# Altium schematic sheet Photodiode Receiver.SchDoc
size A; SheetNumber: 5; SheetTotal: 5
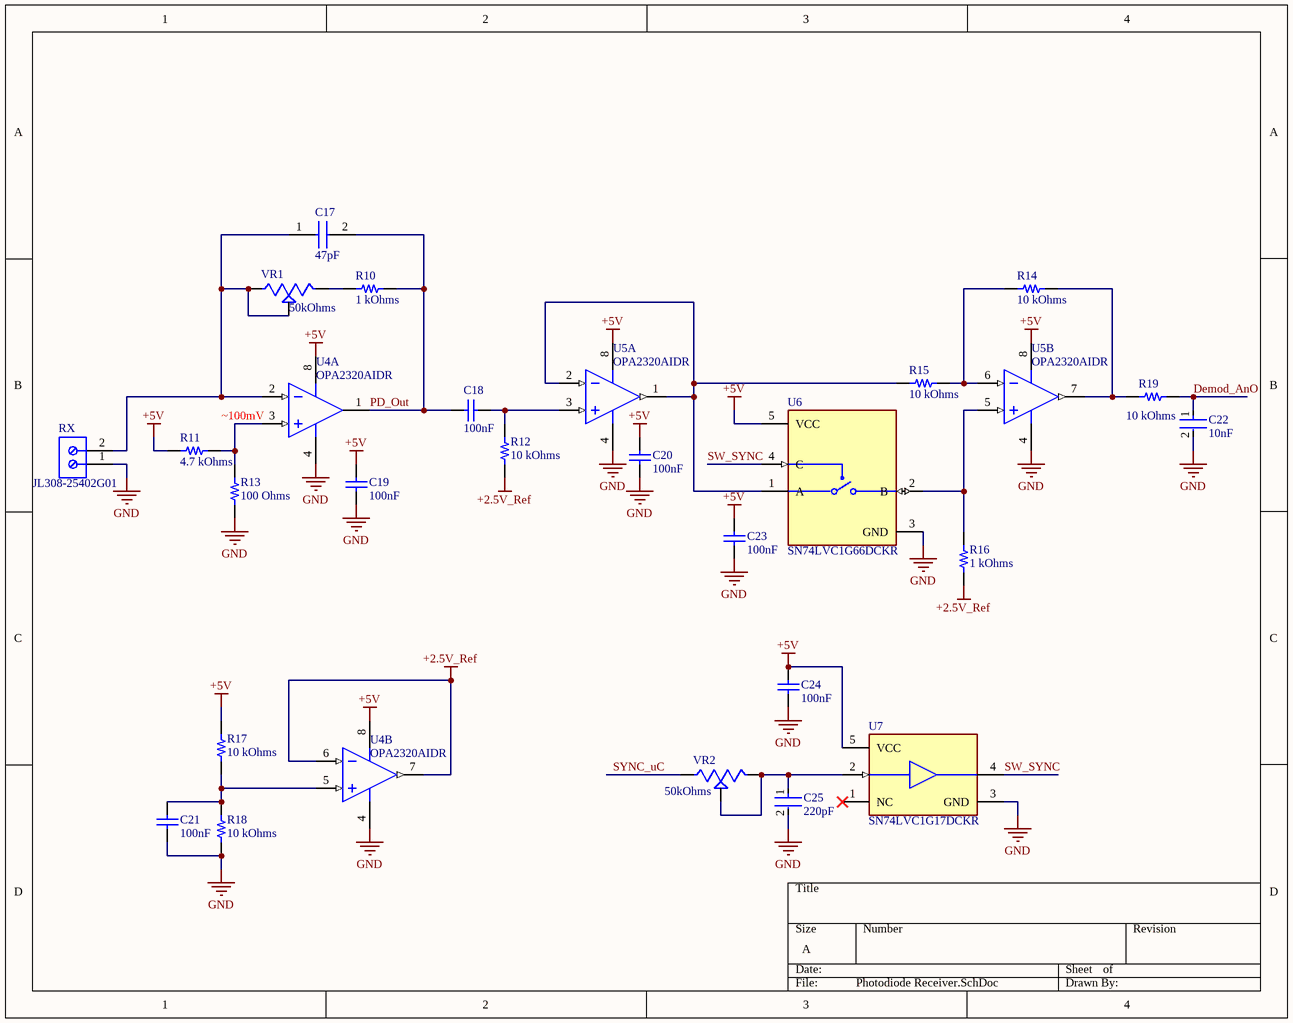
[diagram p0: Photodiode Receiver.SchDoc]

## Parts
C17  47pF  [CAPC1005X55N]
C18  100nF  [CAPC1050X55X23ML05T13]
C19  100nF  [CAPC1050X55X23ML05T13]
C20  100nF  [CAPC1050X55X23ML05T13]
C21  100nF  [CAPC1050X55X23ML05T13]
C22  10nF  [FP-CL165-IPC_C]
C23  100nF  [CAPC1050X55X23ML05T13]
C24  100nF  [CAPC1050X55X23ML05T13]
C25  220pF  [FP-CL10-IPC_A]
R10  1 kOhms  [RES 0402_1005]
R11  4.7 kOhms  [RES 0402_1005]
R12  10 kOhms  [RES 0402_1005]
R13  100 Ohms  [RES 0402_1005]
R14  10 kOhms  [RES 0402_1005]
R15  10 kOhms  [RES 0402_1005]
R16  1 kOhms  [RES 0402_1005]
R17  10 kOhms  [RES 0402_1005]
R18  10 kOhms  [RES 0402_1005]
R19  10 kOhms  [RES 0402_1005]
RX  JL308-25402G01  [691210910002]
U4  OPA2320AIDR  [D0008A_L]  (parts A,B of 2)
U5  OPA2320AIDR  [D0008A_L]  (parts A,B of 2)
U6  SN74LVC1G66DCKR  [FP-DCK0005A-MFG]
U7  SN74LVC1G17DCKR  [FP-DCK0005A-MFG]
VR1  50kOhms  [TRIM_3314J-1-503E]
VR2  50kOhms  [TRIM_3314J-1-503E]

## Nets
+2.5V_Ref: R12.1 R16.2 U4.6(IN_B-) U4.7(OUT_B)
+5V: C19.2 C20.2 C23.2 C24.2 R11.1 R17.2 U4.8(V+) U5.8(V+) U6.5(VCC) U7.5(VCC)
GND: C19.1 C20.1 C21.1 C22.2 C23.1 C24.1 C25.2 R13.1 R18.1 RX.1 U4.4(V-) U5.4(V-) U6.3(GND) U7.3(GND)
Demod_AnO: C22.1 R19.1
PD_Out: C17.2 C18.2 R10.1 U4.1(OUT_A)
SW_SYNC: U6.4(C) U7.4(Y)
SYNC_uC: VR2.3(CW)
NetC17_1: C17.1 RX.2 U4.2(IN_A-) VR1.2(WIPER) VR1.3(CW)
NetC18_1: C18.1 R12.2 U5.3(IN_A+)
NetC21_2: C21.2 R17.1 R18.2 U4.5(IN_B+)
NetC25_1: C25.1 U7.2(A) VR2.1(CCW) VR2.2(WIPER)
NetR10_2: R10.2 VR1.1(CCW)
NetR11_2: R11.2 R13.2 U4.3(IN_A+)
NetR14_1: R14.1 R19.2 U5.7(OUT_B)
NetR14_2: R14.2 R15.1 U5.6(IN_B-)
NetR15_2: R15.2 U5.1(OUT_A) U5.2(IN_A-) U6.1(A)
NetR16_1: R16.1 U5.5(IN_B+) U6.2(B)

Not connected (* = marked no-connect by the designer): U7 1(NC)*

## Notes on the sheet
- ~100mV

## Library data of the parts
C17 = 0402CG470J500NT: Capacitor 0402CG470J500NT; Manufacturer_Name: Guangdong Fenghua Advanced Tech; Datasheet Link: https://datasheet.lcsc.com/szlcsc/Guangdong-Fenghua-Advanced-Tech-0402CG470J500NT_C1567.pdf; Height: 0.55mm; Manufacturer_Part_Number: 0402CG470J500NT
C18-C21 C23 C24 = CMP-2000-05439-1: Chip Capacitor, 100 nF, +/- 10%, 16 V, -55 to 125 degC, 0402 (1005 Metric), RoHS, Tape and Reel; Manufacturer: Samsung Electro-Mechanics; Capacitance: 100000pF; Dielectric: X7R; Rated Voltage: 16V; Case Size/Dimension: 0402; Tolerance (%): ±10%; Manufacturer URL: http://www.samsungsem.com/global/index.jsp; Datasheet URL: https://datasheet.ciiva.com/29198/458718-da-01-en-vs-kondensator-0402-29198423.pdf; Datasheet Version: Nov-10
C22 = CMP-13271-000387-1: Cap Ceramic 10nF 50V X7R ±10% SMD 0402 +125°C Paper T/R; Depth: 0.5mm; Length: 1mm; Lead Free: Lead Free; Case Code (Metric): 1005; Width: 0.02inch; Min Operating Temperature: -55°C; Thickness: 0.022inch; Package Quantity: 1; Mount: Surface Mount; Height: 0.5mm; Voltage: 50V; Material: Ceramic; Tolerance: 10%; Case Code (Imperial): 0402; Radiation Hardening: No; Case/Package: 0402; Max Operating Temperature: 125°C; Voltage Rating (DC): 50V; Contact Plating: Tin; Packaging: Tape and Reel; Voltage Rating: 50V; Capacitance: 10nF; Dielectric: X7R
C25 = CMP-13271-000087-1: Cap Ceramic 220pF 50V X7R ±10% Pad SMD 0603 +125°C T/R; Voltage Rating: 50V; Case Code (Metric): 1608; Radiation Hardening: No; Dielectric: X7R; Mount: Surface Mount; Length: 1.6mm; Thickness: 0.035inch; Packaging: Tape and Reel; Height: 0.8mm; Depth: 0.8mm; Tolerance: 10%; Width: 0.031inch; Case Code (Imperial): 0603; Voltage: 50V; Material: Ceramic; Case/Package: 0603; Capacitance: 220pF; Max Operating Temperature: 125°C; Min Operating Temperature: -55°C; Contact Plating: Tin
R10 R16 = CPF0402B1K0E: RES SMD 1K OHM 0.1% 1/16W 0402; Manufacturer: TE Connectivity Passive Product; Power (Watts): 0.063W, 1/16W; Temperature Coefficient: ±25ppm/°C; Part Number: CPF0402B1K0E; Value: 1 kOhms; ComponentLink1Description: Datasheet; ComponentLink1URL: https://www.te.com/commerce/DocumentDelivery/DDEController?Action=srchrtrv&DocNm=1773200&DocType=DS&DocLang=English; ComponentLink2Description: DigiKey Link; ComponentLink2URL: https://www.digikey.com/en/products/detail/te-connectivity-passive-product/CPF0402B1K0E/4966468; Composition: Thin Film; Device Package: 0402 (1005 Metric); Height - Seated (Max): 0.014" (0.35mm); LastUpdated: 2/9/2024 8:30:24 PM; Lifecycle Status: Active; Minimum Order: 1; Number of Terminations: 2; Operating Temperature: -55°C ~ 155°C; Package / Case: 0402 (1005 Metric); Packaging: TapeAndReel; PartId: 2470; Part Status: Active; Price: 0.10; Resistance: 1 kOhms; Series: CPF, Neohm; Size / Dimension: 0.039" L x 0.020" W (1.00mm x 0.50mm); Supplier 1: DigiKey; Supplier Part Number 1: A119928CT-ND; Supplier Device Package: 0402; Tolerance: ±0.1%
R11 = RR0510P-472-D: RES SMD 4.7K OHM 0.5% 1/16W 0402; Manufacturer: Susumu; Power (Watts): 0.063W, 1/16W; Temperature Coefficient: ±25ppm/°C; Part Number: RR0510P-472-D; Value: 4.7 kOhms; ComponentLink1Description: Datasheet; ComponentLink1URL: http://www.susumu.co.jp/common/pdf/n_catalog_partition05_en.pdf; ComponentLink2Description: DigiKey Link; ComponentLink2URL: https://www.digikey.com/en/products/detail/susumu/RR0510P-472-D/432413; Composition: Thin Film; Device Package: 0402 (1005 Metric); Height - Seated (Max): 0.016" (0.40mm); LastUpdated: 2/9/2024 8:30:21 PM; Lifecycle Status: Active; Minimum Order: 1; Number of Terminations: 2; Operating Temperature: -55°C ~ 125°C; Package / Case: 0402 (1005 Metric); Packaging: TapeAndReel; PartId: 3209; Part Status: Active; Price: 0.01; Resistance: 4.7 kOhms; Series: RR; Size / Dimension: 0.039" L x 0.020" W (1.00mm x 0.50mm); Supplier 1: DigiKey; Supplier Part Number 1: RR05P4.7KDCT-ND; Tolerance: ±0.5%
R12 R14 R15 R17-R19 = CRCW040210K0FKEE: RES SMD 10K OHM 1% 1/16W 0402; Manufacturer: Vishay Dale; Power (Watts): 0.063W, 1/16W; Temperature Coefficient: ±100ppm/°C; Part Number: CRCW040210K0FKEE; Value: 10 kOhms; ComponentLink1Description: Datasheet; ComponentLink1URL: http://www.vishay.com/docs/20035/dcrcwe3.pdf; ComponentLink2Description: DigiKey Link; ComponentLink2URL: https://www.digikey.com/en/products/detail/vishay-dale/CRCW040210K0FKEE/5069897; Composition: Thick Film; Device Package: 0402 (1005 Metric); Features: Automotive AEC-Q200; Height - Seated (Max): 0.016" (0.40mm); LastUpdated: 2/9/2024 8:30:20 PM; Lifecycle Status: Active; Minimum Order: 1; Number of Terminations: 2; Operating Temperature: -55°C ~ 155°C; Package / Case: 0402 (1005 Metric); Packaging: CutTape; PartId: 3471; Part Status: Active; Price: 0.01; Ratings: AEC-Q200; Resistance: 10 kOhms; Series: CRCW; Size / Dimension: 0.039" L x 0.020" W (1.00mm x 0.50mm); Supplier 1: DigiKey; Supplier Part Number 1: 541-2954-1-ND; Supplier Device Package: 0402; Tolerance: ±1%
R13 = RR0510P-101-D: RES SMD 100 OHM 0.5% 1/16W 0402; Manufacturer: Susumu; Power (Watts): 0.063W, 1/16W; Temperature Coefficient: ±25ppm/°C; Part Number: RR0510P-101-D; Value: 100 Ohms; ComponentLink1Description: Datasheet; ComponentLink1URL: http://www.susumu.co.jp/common/pdf/n_catalog_partition05_en.pdf; ComponentLink2Description: DigiKey Link; ComponentLink2URL: https://www.digikey.com/en/products/detail/susumu/RR0510P-101-D/432375; Composition: Thin Film; Device Package: 0402 (1005 Metric); Height - Seated (Max): 0.016" (0.40mm); LastUpdated: 2/9/2024 8:30:21 PM; Lifecycle Status: Active; Minimum Order: 1; Number of Terminations: 2; Operating Temperature: -55°C ~ 125°C; Package / Case: 0402 (1005 Metric); Packaging: TapeAndReel; PartId: 3205; Part Status: Active; Price: 0.01; Resistance: 100 Ohms; Series: RR; Size / Dimension: 0.039" L x 0.020" W (1.00mm x 0.50mm); Supplier 1: DigiKey; Supplier Part Number 1: RR05P100DCT-ND; Tolerance: ±0.5%
RX = CMP-1502-02456-2: Use comment for part number; NexarPartId: 105950649; Current Rating: 6A; Voltage Rating: 150V; Number of Contacts: 2; Number of Rows: 1; Contact Material: Tin; Height: 8.7mm; Max Operating Temperature: 105°C; Min Operating Temperature: -40°C
U4 U5 = CMP-0272-00771-3: Precision, 20 MHz, 0.9 pA Ib, RRIO, CMOS Operational Amplifier, 1.8 to 5.5 V, -40 to 125 degC, 8-pin SOIC (D8), Green (RoHS & no Sb/Br); Manufacturer: Texas Instruments; IIB(Max)(pA): 400; Iq per channel(Max)(mA): 1.6; Number of Channels: 2; Total Supply Voltage(Min)(+5V is 5, +/-5V is 10): 1.8; CMRR(Min)(dB): 100; Slew Rate(Typ)(V/us): 10; Vio (25C)(Max)(mV): 0.15; Total Supply Voltage(Max)(+5V is 5, +/-5V is 10): 5.5; Vn at 1kHz(Typ)(nV/rtHz): 8.5; Sub Family: High Output Current Amplifier (>=50mA), Low Input Bias Current Amp (<=10pA), Low Noise Amp (<=10nV/rtHz), Low Offset Voltage Amplifier (<=500uV), Low Supply Voltage Amplifier (<=2.7V), Precision Amplifier; Offset Drift(Typ)(uV/C): 1.5; Code_JEDEC: MS-012; Eco-Plan: Green (RoHS & no Sb/Br); ComponentLink3URL: http://www.ti.com/litv/pdf/msoi002j; PackageVersion: 4040047-3/M, 06/2011; ComponentLink2URL: http://www.ti.com/general/docs/lit/getliterature.tsp?genericPartNumber=OPA2320&fileType=pdf; DatasheetVersion: SBOS513D; ComponentLink3Description: Package Specification; Mounting Technology: Surface Mount; PackageReference: D0008A; PackageDescription: 8-Pin Plastic Small Outline, Body 4.9 x 3.9 mm, Pitch 1.27 mm; PartNumber: OPA2320AIDR; ComponentLink1Description: Manufacturer URL; ComponentLink1URL: http://www.ti.com/; ComponentLink2Description: Datasheet
U6 = CMP-0859-00385-4: IC SWITCH 1X1 SC70-5; Manufacturer: Texas Instruments; Throw Configuration: SPST-NO; Nominal Supply Current: 1uA; Max Supply Voltage: 5.5V; Standoff Height: 0mm; -3Db Bandwith: 300MHz; On State Resistance: 5.5Ω; Mux Demux Ratio: 1:1; Max Junction Temp: +150°C; Min Supply Voltage: 1.65V; Number Of Circuits: 1; Octopart: https://octopart.com/sn74lvc1g66dckr-texas+instruments-472215; Temperature Range Low: -40°C; Mouser Description: Analogue Switch, Single Channel, SPST, 1, 10 ohm, 1.65V to 5.5V, SC-70, 5; Height: 1.1mm; ComponentLink2Description: Datasheet; RoHS: TRUE; Package: DCK0005A; Manufacturer Part Number: SN74LVC1G66DCKR; Digikey Description: IC SWITCH 1X1 SC70-5; Temperature: -40°C to +85°C; Temperature Range High: +85°C; ComponentLink2URL: http://www.ti.com/lit/ds/symlink/sn74lvc1g66.pdf; Lead Free: Yes; Device Class L3: Analog Switches; Device Class L2: Interface ICs; Ambient Temperature Range High: +85°C; Ambient Temperature Range Low: -40°C; Category: IC; Automotive: No; Device Class L1: Integrated Circuits (ICs)
U7 = CMP-0859-00388-5: IC BUF NON-INVERT 5.5V SC70-5; Number of Elements: 1; Polarity: Non-Inverting; Low Level Output Current: 32mA; Propagation Delay: 11ns; Logic Function: Schmitt Trigger; Min Supply Voltage: 1.65V; Quiescent Current: 1.5uA; High Level Output Current: -32mA; Packaging: Tape and Reel; Number of Gates: 1; Number of Output Lines: 1; Package Quantity: 1; Radiation Hardening: No; Max Supply Voltage: 5.5V; Contact Plating: Gold; Number of Outputs: 1; Number of Channels: 1; Termination: SMD/SMT; REACH SVHC: No SVHC; Number of Inputs: 1; Turn-On Delay Time: 11ns; Min Operating Temperature: -40°C; Number of Bits: 1; Number of Input Lines: 1; Number of Bits per Element: 1; Case/Package: SC; Number of Pins: 5; Mount: Surface Mount; Lead Free: Lead Free; Max Operating Temperature: 125°C
VR1 VR2 = 3314J-1-503E: Trimmer, Cermet, Rest 50 Kilohms, SMD, 1 Turn, Pwr-Rtg 0.25W | Bourns 3314J-1-503E; SnapEDA_Link: https://www.snapeda.com/parts/3314J-1-503E/Bourns/view-part/?ref=snap; Package: NON STANDARD-4 Bourns; Value: *; MF: Bourns; MP: 3314J-1-503E; Check_prices: https://www.snapeda.com/parts/3314J-1-503E/Bourns/view-part/?ref=eda